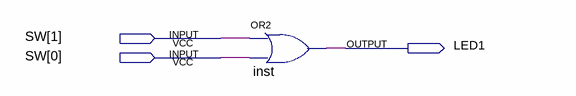
[diagram p0: schematic sheet]
// Quartus schematic ex1.bdf as structural Verilog: 1 symbols, 3 pins
module ex1 (
  input  [1:0] SW,
  output LED1
);

  or inst (LED1, SW[1], SW[0]);
endmodule
